# EAGLE design BoardSchematic (EAGLE 7.3.0)
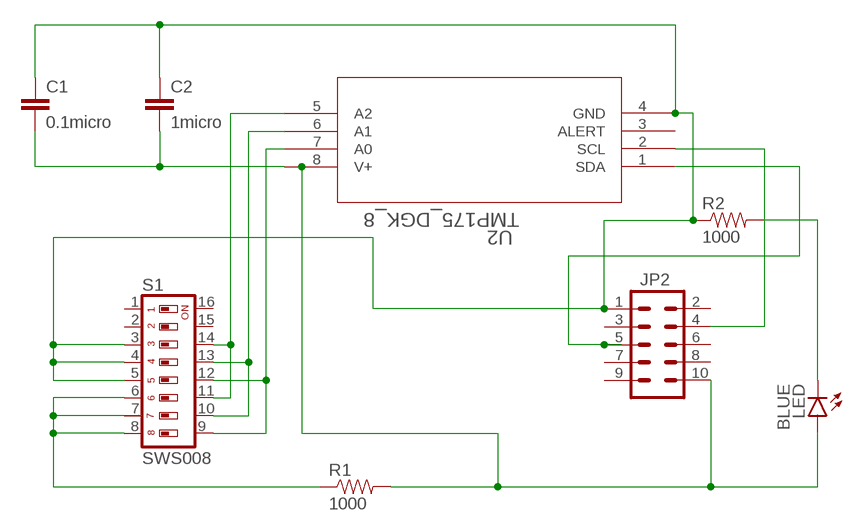
[diagram p0: schematic, sheet 1]

## Parts
C1  0.1micro  22UF-6.3V-20%(0805)  [0805]
C2  1micro  22UF-16V-20%-(1210)  [1210]
JP2  M05X2PTH  [AVR_ICSP]
LED  BLUE  LED-BLUE1206  [LED-1206]
R1  1000  RESISTOR0805-RES  [0805]
R2  1000  RESISTOR0805-RES  [0805]
S1  SWS008  [SMS-008]
U2  TMP175_DGK_8  [DGK8]

## Nets
N$1: C1.2 C2.2 U2.8(V+)
N$2: JP2.4 U2.2(SCL)
N$3: C1.1 C2.1 JP2.1 R2.1 S1.3 S1.4 S1.5 U2.4(GND)
N$4: R1.1 S1.6 S1.8
N$5: S1.10 S1.13 U2.6(A1)
N$6: S1.9 S1.12 U2.7(A0)
N$7: S1.11 S1.14 U2.5(A2)
N$9: LED.C R2.2
N$10: JP2.10 LED.A R1.2
N$11: JP2.5 U2.1(SDA)
Unconnected: JP2.2 JP2.3 JP2.6 JP2.7 JP2.8 JP2.9 S1.1 S1.2 S1.7 S1.15 S1.16 U2.3(ALERT)

## Library data of the parts
C1 = SparkFun-Capacitors:22UF-6.3V-20%(0805): CAP-08402 Ceramic; PROD_ID: CAP-08402; VALUE: 22uF
C2 = SparkFun-Capacitors:22UF-16V-20%-(1210): CAP-10381; PROD_ID: CAP-10381; VALUE: 22uF
JP2 = SparkFun-Connectors:M05X2: Header 5x2 Standard 10-pin dual row 0.1" header. Commonly used with AVR-ISP. Use with Spark Fun Electronics SKU: PRT-00778
LED = SparkFun-LED:LED-BLUE: Blue LEDs for production use Various blue LEDs stocked by SparkFun production 0603 - DIO-08575 Rebel - DIO-09553 1206 - DIO-09911; PROD_ID: DIO-09911
R1 R2 = SparkFun-Resistors:RESISTOR: Resistor Basic schematic elements and footprints for 0603, 1206, and PTH resistors.
S1 = smd-special:SWS008: SMD Dip Switch 8 pol.
U2 = EagleNew:TMP175_DGK_8; DATASHEETURL: http://www.ti.com/lit/gpn/TMP175; DESCRIPTION: Digital Temperature Sensor with 2-Wire Interface; FAMILY_NAME: TEMPERATURE SENSOR; GENERIC_PART_NUMBER: TMP175; INDUSTRY_STD_PKG_TYPE: MSOP; MANUFACTURER: Texas Instruments; MANUFACTURER_PART_NUMBER: tmp175_dgk_8; PACKAGE_DESIGNATOR: DGK; PIN_COUNT: 8; VENDOR: Texas Instruments

## Net classes
0 default: width 0.025 mm, drill 0.508 mm, clearance 0.254 mm

## Board
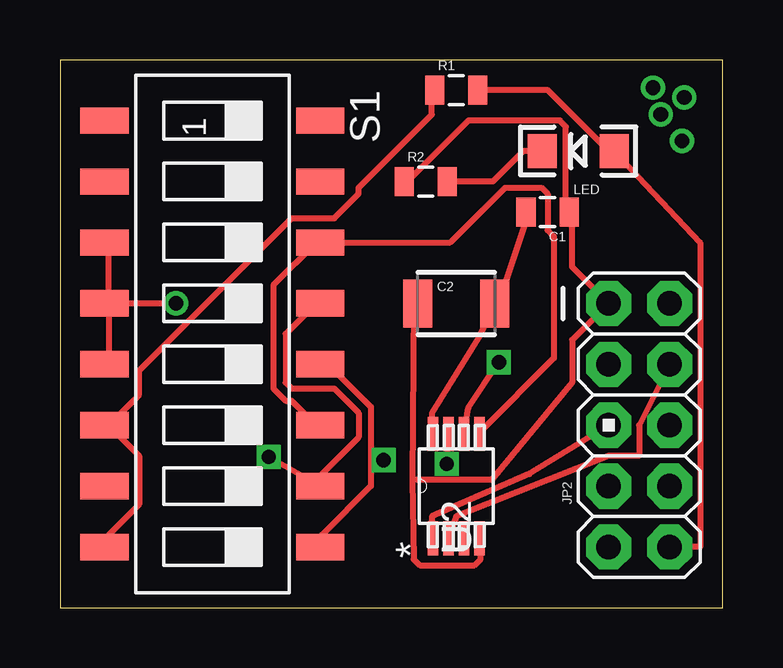
[diagram p1: board, top side]
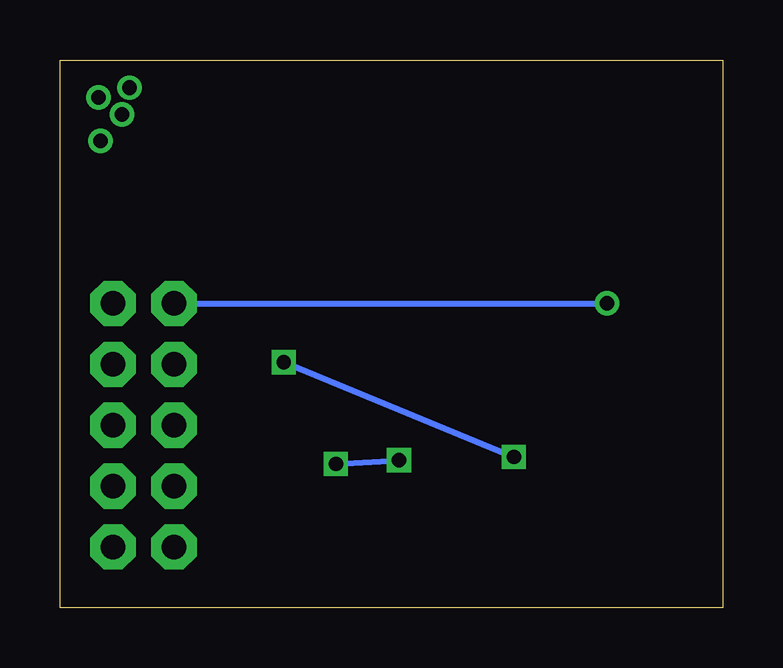
[diagram p2: board, bottom side, seen from below]

Size 27.61 x 22.85 mm. Coordinates in mm from the lower left corner, seen from the top.
Outline: 0,0 27.61,0 27.61,22.85 0,22.85 0,0
Copper layers (1*16): Top 0.035mm / dielectric 1.5mm / Bottom 0.035mm
Design rules "default": minimum track width 10mil, minimum drill 24mil, track to track 8mil, track to pad 8mil, pad to pad 8mil, via to via 8mil, smd to smd 8mil, copper to edge 40mil, drill to drill 8mil, minimum pad ring 10mil, minimum via ring 8mil, stop-mask expansion 4mil, vias tented up to drill 0mil, thermal gap 10mil

### Footprints (pad centres in the part's own frame; a part is rotated, then mirrored left to right if it is on the bottom)
0805 = smd 0.8 x 1.2: 1 -0.9,0; 2 0.9,0
1210 = smd 1.2 x 2: 1 -1.6,0; 2 1.6,0
AVR_ICSP = drill 1.016 pad 1.88 octagon: 1 -1.27,5.08; 2 1.27,5.08; 3 -1.27,2.54; 4 1.27,2.54; 5 -1.27,0; 6 1.27,0; 7 -1.27,-2.54; 8 1.27,-2.54; 9 -1.27,-5.08; 10 1.27,-5.08
LED-1206 = smd 1.2 x 1.4: A -1.5,0; C 1.5,0
SMS-008 = smd 1.092 x 2.007: 1 -8.89,-4.496; 2 -6.35,-4.496; 3 -3.81,-4.496; 4 -1.27,-4.496; 5 1.27,-4.496; 6 3.81,-4.496; 7 6.35,-4.496; 8 8.89,-4.496; 9 8.89,4.496; 10 6.35,4.496; 11 3.81,4.496; 12 1.27,4.496; 13 -1.27,4.496; 14 -3.81,4.496; 15 -6.35,4.496; 16 -8.89,4.496
DGK8 = smd 1.422 x 0.432: 1 -2.172,0.975; 2 -2.172,0.325; 3 -2.172,-0.325; 4 -2.172,-0.975; 5 2.172,-0.975; 6 2.172,-0.325; 7 2.172,0.325; 8 2.172,0.975

### Placement (x,y rotation side)
C1  20.32,16.51 180 top
C2  16.51,12.7 0 top
JP2  24.13,7.62 0 top
LED  21.59,19.05 180 top
R1  16.51,21.59 0 top
R2  15.24,17.78 0 top
S1  6.35,11.43 270 top
U2  16.51,5.08 90 top

### Tracks (layer width: path | path; a pad name or v marks a point on that pad's centre or on a via)
N$1
  Top 0.254: C1.2 19.56,16.51 18.29,12.7 C2.2 17.53,11.43 15.49,8.13 15.49,7.37 U2.8
N$2
  Top 0.254: JP2.4 24.13,7.62 24.13,6.35 22.86,6.35 16.51,3.81 U2.2
N$3  (via drill 0.61)
  Top 0.254: 14.68,5.33 14.73,2.03 14.99,1.78 17.27,1.78 17.53,2.03 17.53,2.79 U2.4 | C2.1 14.73,12.7 14.68,5.33 | 2.03,12.7 2.03,10.16 S1.5 | 2.03,12.7 2.03,15.24 S1.3 | R2.1 14.48,17.78 17.02,20.32 20.83,20.32 21.08,20.07 21.08,16.51 C1.1 21.34,16.51 21.34,14.22 JP2.1 21.34,11.18 21.34,9.4 17.98,5.33 14.68,5.33 | v4.83,12.7 2.03,12.7 | 2.03,12.7 S1.4
  Bottom 0.254: JP2.1 v4.83,12.7
  other vias: 26.01,21.29 25.92,19.47 24.71,21.69 25.03,20.57
N$4
  Top 0.254: 2.03,7.62 3.3,8.89 3.3,9.91 9.65,16.26 11.43,16.26 12.45,17.27 12.45,17.53 15.49,20.57 15.49,21.59 R1.1 | 2.03,7.62 3.3,6.35 3.3,4.32 2.03,3.05 2.03,2.54 S1.8 | 2.03,7.62 S1.6
N$5  (via drill 0.6)
  Top 0.254: S1.13 10.67,12.7 9.4,11.43 9.4,9.4 9.65,9.14 11.43,9.14 12.45,8.13 12.45,7.11 10.92,5.59 10.92,5.08 S1.10 v8.7,6.3 | U2.6 17.02,8.33 v18.29,10.25
  Bottom 0.254: v18.29,10.25 v8.7,6.3
N$6  (via drill 0.6)
  Top 0.254: 12.95,6.06 12.95,8.38 11.18,10.16 S1.12 | 12.95,6.06 12.95,5.08 10.92,3.05 10.92,2.54 S1.9 | U2.7 v16.12,6.01 | v13.49,6.16 12.95,6.06
  Bottom 0.254: v16.12,6.01 v13.49,6.16
N$7
  Top 0.254: U2.5 17.53,7.37 20.57,10.41 20.57,15.49 20.32,15.75 20.32,17.27 20.07,17.53 18.54,17.53 16.26,15.24 S1.14 10.67,15.24 8.89,13.46 8.89,9.14 9.4,8.64 9.65,8.64 10.67,7.62 S1.11
N$9
  Top 0.254: R2.2 18.03,17.78 19.3,19.05 LED.C
N$10
  Top 0.254: R1.2 20.32,21.59 22.86,19.05 LED.A 26.67,15.24 26.67,2.54 JP2.10
N$11
  Top 0.254: JP2.5 19.56,5.59 15.49,3.81 15.49,3.05 U2.1